# EasyEDA Pro project WearableGasDetect.epro, schematic Schematic4
Create Date: 2025-02-12; Page Name: P1; Project Name: 25大创; Schematic Name: Schematic4; Update Date: 2025-02-22; Company: 嘉立创EDA; Page Size: A4; Version: V1.0
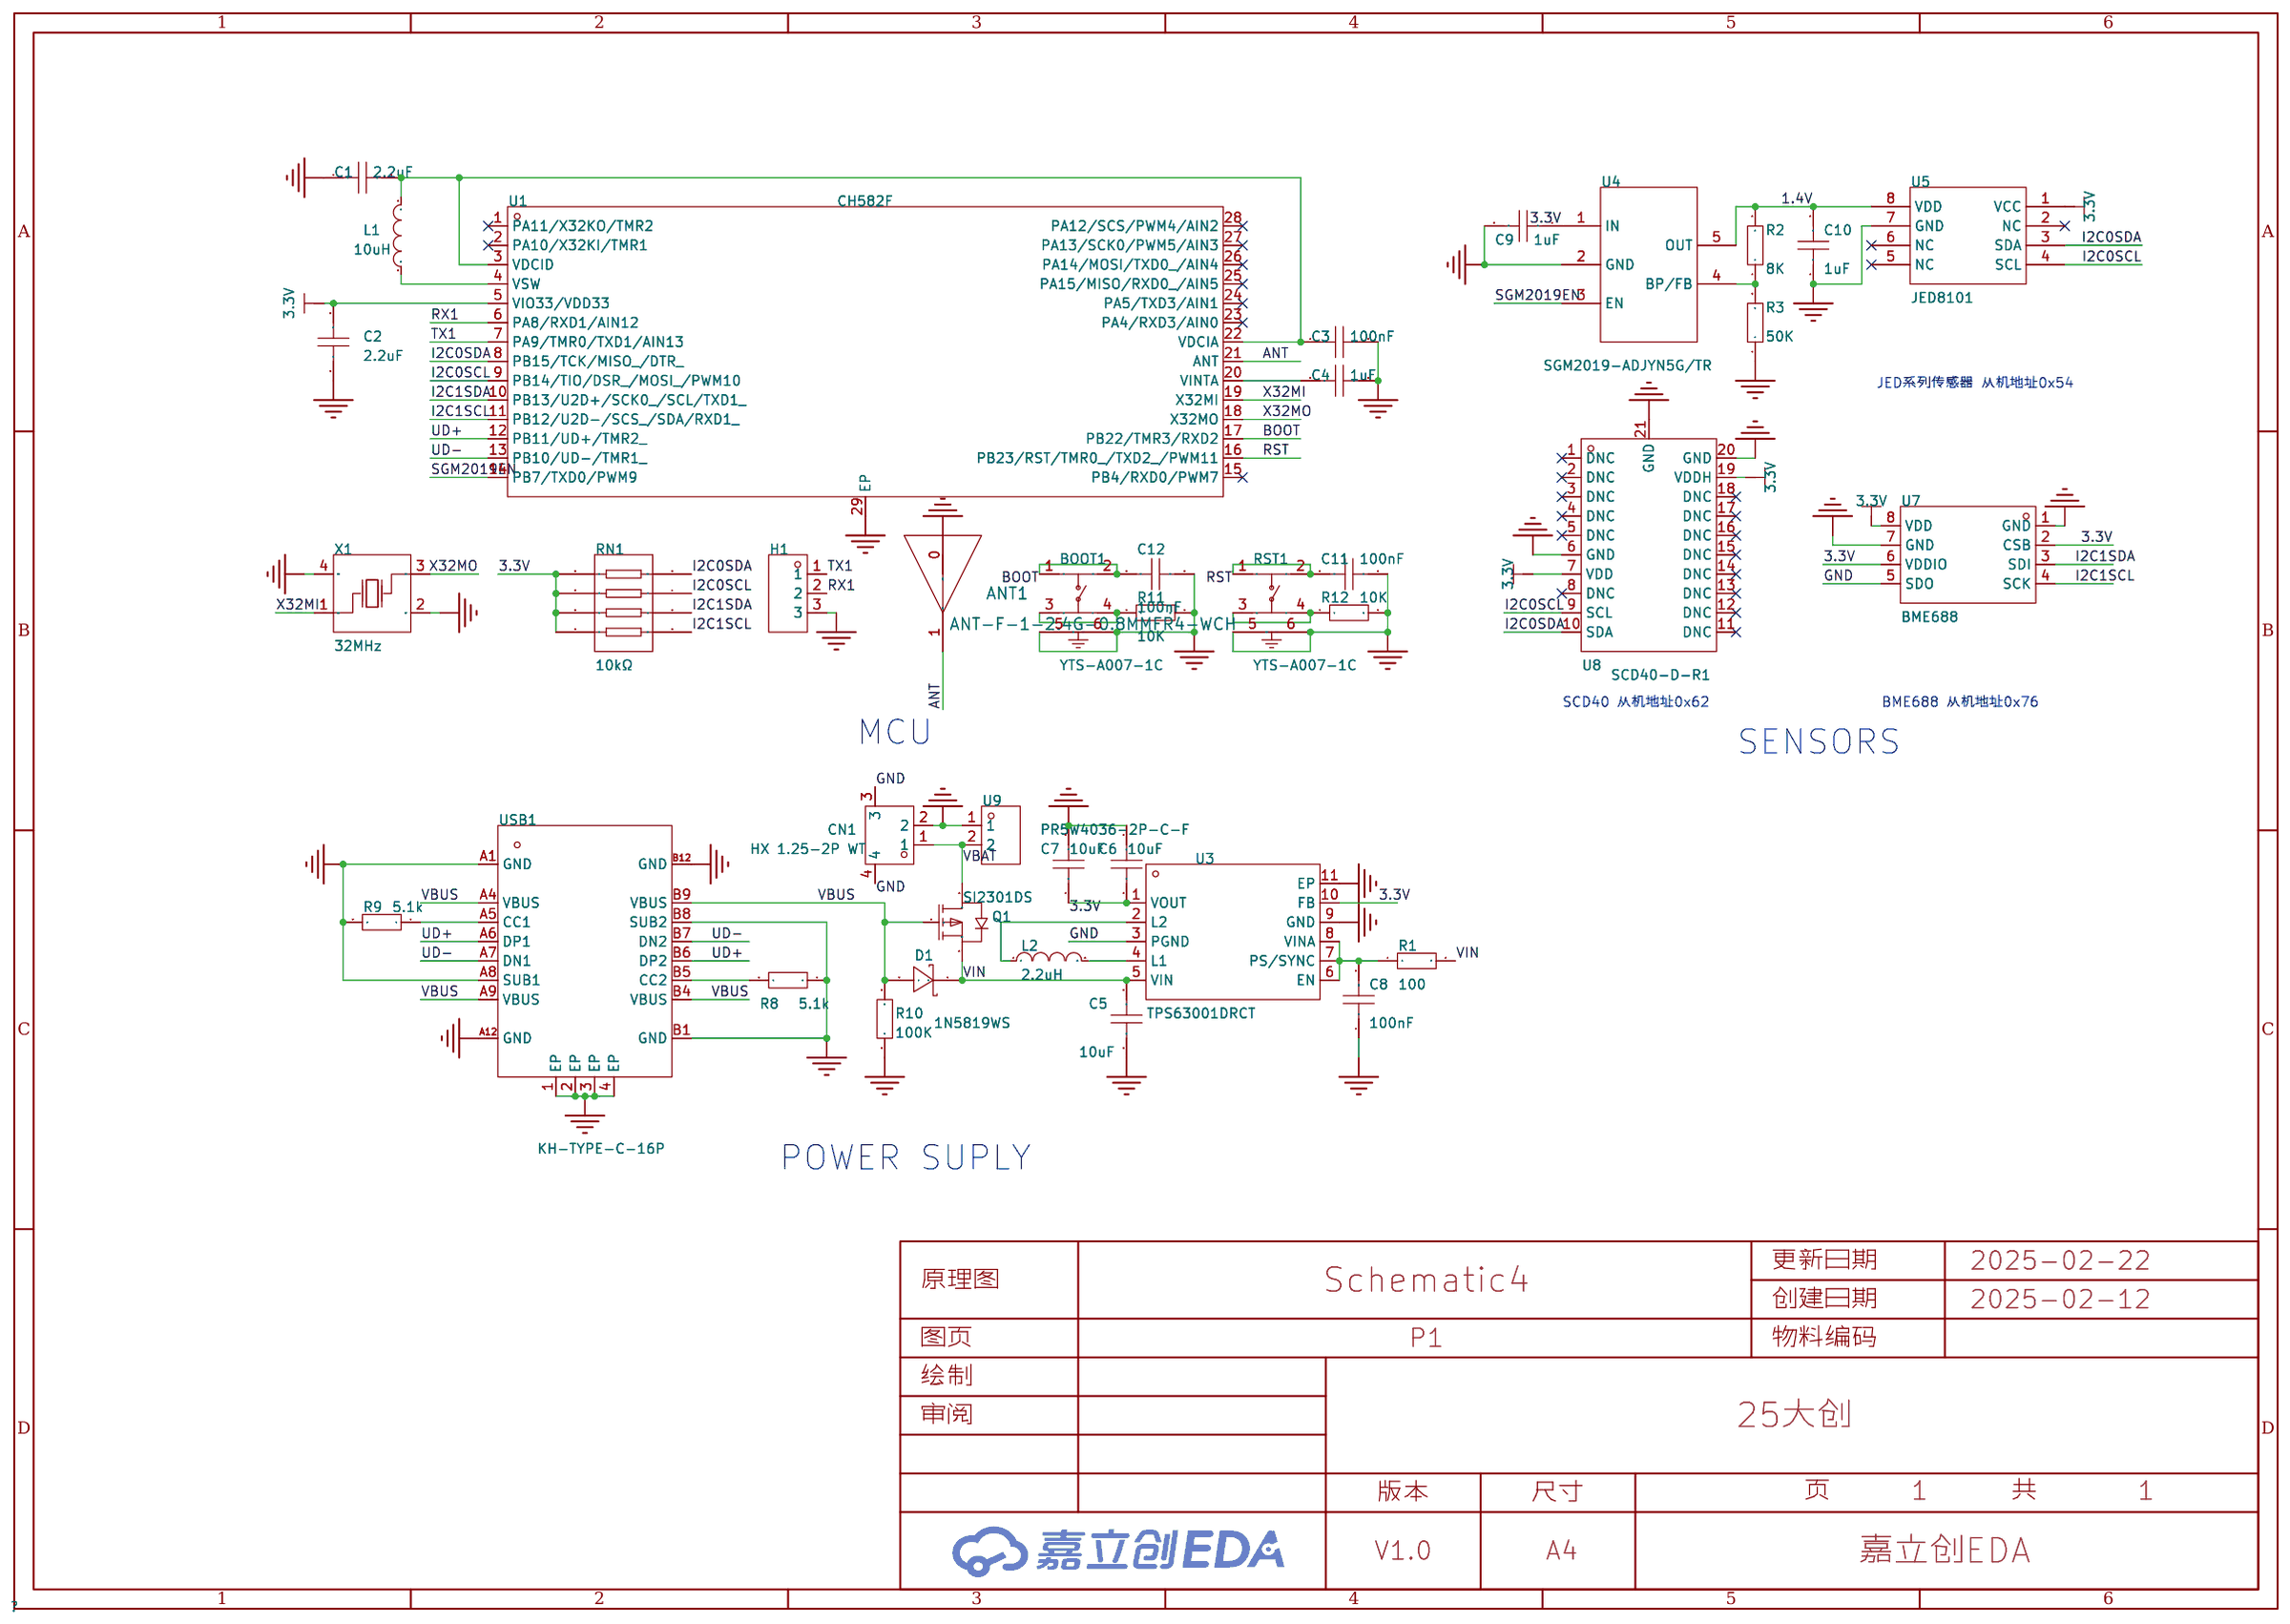
[diagram p2: schematic sheet]

## Parts
ANT1  ANT-F-1-2.4G-0.8MMFR4-WCH  [ANT-F-1-2.4G-0.8MMFR4-WCH]
BOOT1  YTS-A007-1C  [SW-SMD_6P-L3.4-W3.4-P2.00-LS4.0]
C1  2.2uF  [C0402]
C2  2.2uF  [C0402]
C3  100nF  [C0402]
C4  1uF  [C0402]
C5  10uF  [C0603]
C6  10uF  [C0603]
C7  10uF  [C0603]
C8  100nF  [C0402]
C9  1uF  [C0402]
C10  1uF  [C0402]
C11  100nF  [C0402]
C12  100nF  [C0402]
CN1  HX 1.25-2P WT  [CONN-SMD_2P-P1.25_HX1.25-2PWT]
D1  1N5819WS  [SOD-323_L1.8-W1.3-LS2.5-RD]
H1  -  [HDR-TH_3P-P2.54-V-F]
L1  10uH  [IND-SMD_L2.5-W2.0]
L2  2.2uH  [IND-SMD_L4.0-W4.0_VLS4012ET]
Q1  SI2301DS  [SOT-23-3_L2.9-W1.3-P1.90-LS2.4-BR]
R1  100  [R0402]
R2  8K  [R0402]
R3  50K  [R0402]
R8  5.1k  [R0402]
R9  5.1k  [R0402]
R10  100K  [R0402]
R11  10K  [R0402]
R12  10K  [R0402]
RN1  10kΩ  [RES-ARRAY-SMD_0603-8P-L3.2-W1.6-BL]
RST1  YTS-A007-1C  [SW-SMD_6P-L3.4-W3.4-P2.00-LS4.0]
U1  CH582F  [QFN-28_L4.0-W4.0-P0.40-BL-EP2.8]
U3  TPS63001DRCT  [VSON-10_L3.0-W3.0-P0.50-TL-EP]
U4  SGM2019-ADJYN5G/TR  [SOT-23-5_L3.0-W1.7-P0.95-LS2.8-BR]
U5  JED8101  [JED8101]
U7  BME688  [LGA-8_L3.0-W3.0-P0.80_BME688]
U8  SCD40-D-R1  [LGA-20_L10.1-W10.1-P1.25-TL]
U9  PR5W4036-2P-C-F  [CONN-TH_PR5W4036-2P-C-F]
USB1  KH-TYPE-C-16P  [USB-C-SMD_KH-TYPE-C-16P]
X1  32MHz  [CRYSTAL-SMD_4P-L3.2-W2.5-BL]

## Library data of the parts
ANT1 = ANT-F-1-2.4G-0.8MMFR4-WCH
BOOT1 RST1 = YTS-A007-1C: 电路结构:单刀单掷;按钮形状:圆形按钮;作用力:160gf;安装方式:立贴;开关长度:3.4mm;开关宽度:3.35mm;开关高度:2mm;带支架:不带;触点电流:50mA;额定电压(DC):12V;绝缘电阻:100MΩ;机械寿命:10万次;; LCSC Part Name: 3.4*3.35*2mm 立贴 轻触开关; Supplier Part: C2910660; Manufacturer: YIYUAN(怡远); Supplier Footprint: SMD; Datasheet: https://atta.szlcsc.com/upload/public/pdf/source/20211115/F701EB4F96D863066ABC82C6FE41162B.pdf; Supplier: LCSC; Circuit: 单刀单掷; Actuator Style: 圆形按钮; Operating Force: 160gf; Mounting Style: 立贴; Switch Length: 3.4mm; Switch Width: 3.35mm; Switch Height: 2mm; Strike Gundam: 不带; Contact Current: 50mA; Voltage Rating (DC): 12V; Insulation Resistance: 100MΩ; Actuator/Cap Color: 黑色; Pin Style: SMD接片; Mechanical Life: 10万次
C1-C4 C8-C12 = CAP_0402: Supplier Footprint: 0402
C5-C7 = CAP_0603: Supplier Footprint: 0603
CN1 = HX 1.25-2P WT: 插针结构:1x2P;间距:1.25mm;安装方式:卧贴;总PIN数:2P;排数:1;每排PIN数:2;额定电流:1A;工作温度范围:-25℃~+85℃;; LCSC Part Name: 1x2P 间距:1.25mm 卧贴; Supplier Part: C5142069; Manufacturer: hanxia(韩下); Supplier Footprint: SMD,P=1.25mm,卧贴; Datasheet: https://atta.szlcsc.com/upload/public/pdf/source/20220818/902167240A14414EBE70E0F5623727B7.pdf; Supplier: LCSC; Pins Structure: 1x2P; Pitch: 1.25mm; Mounting Style: 卧贴; Number of Pins: 2P; Number of Rows: 1; Number of PINs Per Row: 2; Current Rating (Max): 1A; Operating Temperature Range: -25℃~+85℃
D1 = 1N5819WS_C191023: 正向压降(Vf):600mV@1A;直流反向耐压(Vr):40V;整流电流:1A;; LCSC Part Name: 电压:40V 电流:1A; Supplier Part: C191023; Manufacturer: Hottech(合科泰); Supplier Footprint: SOD-323; JLCPCB Part Class: 基础库; Datasheet: https://atta.szlcsc.com/upload/public/pdf/source/20220428/3CB86FD8D28D653594B4E35F9D5AEFD9.pdf; Supplier: LCSC; Forward Voltage (Vf@If): 600mV@1A; Reverse Voltage (Vr): 40V; Rectified Current: 1A
H1 = HDR-F_2.54_1x3P: Supplier Part: C541850; Supplier Footprint: 插件
L1 = FTC252012S100MBCA: 电感值:10uH;精度:±20%;额定电流:1.2A;饱和电流(Isat):1.6A;类型:一体成型电感;; LCSC Part Name: 10uH ±20% 1.6A; Supplier Part: C5832376; Manufacturer: cjiang(长江微电); Supplier Footprint: SMD,2x2.5mm; Datasheet: https://atta.szlcsc.com/upload/public/pdf/source/20230602/8FFEDA9C0247A92A0D4B67554BFE4091.pdf; Supplier: LCSC; Tolerance: ±20%; Rated Current: 1.2A; Saturation Current (Isat): 1.6A; DC Resistance (DCR): 330mΩ; Type: 一体成型电感
L2 = VLS4012ET-2R2M: 电感值:2.2uH;精度:±20%;额定电流:1.7A;饱和电流(Isat):1.7A;类型:-;; LCSC Part Name: 2.2uH ±20% 1.7A; Supplier Part: C76867; Manufacturer: TDK; Supplier Footprint: SMD; Datasheet: https://atta.szlcsc.com/upload/public/pdf/source/20180327/C76870_107D5296010FCD8D7FC5AB0C4DA9E818.pdf; Supplier: LCSC; Tolerance: ±20%; Rated Current: 1.7A; Saturation Current (Isat): 1.7A; DC Resistance (DCR): 81mΩ
Q1 = SI2301DS: 类型:-;漏源电压(Vdss):20V;连续漏极电流(Id):3A;导通电阻(RDS(on)@Vgs,Id):110mΩ@4.5V,3A;功率(Pd):1W;阈值电压(Vgs(th)@Id):1V@250uA;; LCSC Part Name: 耐压:20V 电流:3A; Supplier Part: C2841444; Manufacturer: TECH PUBLIC(台舟); Supplier Footprint: SOT-23-3; JLCPCB Part Class: 扩展库; Datasheet: https://atta.szlcsc.com/upload/public/pdf/source/20210623/C2841444_F8915202D3D7667D175CCC150AA2E443.pdf; Supplier: LCSC; Drain Source Voltage (Vdss): 20V; Continuous Drain Current (Id): 3A; Drain Source On Resistance (RDS(on)@Vgs,Id): 110mΩ@4.5V,3A; Power Dissipation (Pd): 1W; Gate Threshold Voltage (Vgs(th)@Id): 1V@250uA; Total Gate Charge (Qg@Vgs): 12nC@10V; Input Capacitance (Ciss@Vds): 405pF@10V; Reverse Transfer Capacitance (Crss@Vds): 55pF@10V; Operating Temperature: -55℃~+150℃
R1-R3 R8-R12 = Res_0402: Supplier Footprint: 0402
RN1 = 4D03WGJ0103T5E: 电阻器数:4;阻值:10kΩ;精度:±5%;单个元件功率:62.5mW;温度系数:±200ppm/℃;; LCSC Part Name: 10kΩ ±5%; Supplier Part: C29718; Manufacturer: UNI-ROYAL(厚声); Supplier Footprint: 0603x4; Datasheet: https://atta.szlcsc.com/upload/public/pdf/source/20191224/C474318_2527498AE30E813171187CCD28401A71.pdf; Supplier: LCSC; Number of Resistors: 4; Tolerance: ±5%; Power(Watts): 62.5mW; Temperature Coefficient: ±200ppm/℃; Number of Pins: 8
U1 = CH582F: Supplier Part: C3001175; Manufacturer: WCH(南京沁恒); Supplier Footprint: QFN-28-EP(4x4); Datasheet: https://atta.szlcsc.com/upload/public/pdf/source/20220425/D81D4537E275CD6C7C3E77BC95B144F3.pdf; Supplier: LCSC
U3 = TPS63001DRCT: 功能类型:升降压型;输出类型:固定;输入电压:1.8V~5.5V;输出电压:3.3V;输出电流:1.6A;; LCSC Part Name: TPS6300x 高效单电感降压-升压转换器; Supplier Part: C2070693; Manufacturer: TI(德州仪器); Supplier Footprint: VSON-10-EP(3x3); Datasheet: https://www.ti.com/cn/lit/gpn/tps63000; Supplier: LCSC; Function: 升降压型; Output Type: 固定; Input Voltage: 1.8V~5.5V; Output Voltage: 3.3V; Output Current: 1.6A; Switching Frequency: 1.5MHz; Operating Temperature: -40℃~+85℃@(TA); Synchronous Rectification: 是; Number of Outputs: 1; Topology: 降压-升压式; Switch tube (built-in/external): 内置
U4 = SGM2019-ADJYN5G/TR: 输出类型:-;; Supplier Part: C24330; Manufacturer: SGMICRO(圣邦微); Supplier Footprint: SOT-23-5; Datasheet: https://atta.szlcsc.com/upload/public/pdf/source/20190710/C403702_087BBF2DB9DA7C127CC5D0EF964E6982.pdf; Supplier: LCSC
U5 = JED8101
U7 = BME688_C3664478: 低功耗湿度和温度数字传感器; Supplier Part: C3664478; Manufacturer: Bosch(博世); Supplier Footprint: SMD-8P; Datasheet: https://atta.szlcsc.com/upload/public/pdf/source/20231017/7B3D7968BB5F8FA300E4D9B7C8303659.pdf; Supplier: LCSC
U8 = SCD40-D-R1: 气体类型:空气质量;精度:±5%;; LCSC Part Name: 3.000.496; Supplier Part: C3037696; Manufacturer: Sensirion(瑞士盛思锐); Supplier Footprint: SMD; Datasheet: https://atta.szlcsc.com/upload/public/pdf/source/20230320/B8496A095FB9AF4BA49DBD56DDF6C7AD.pdf; Supplier: LCSC; Type: 空气质量; Resolution: ±5%; Operating Temperature: -10℃~+60℃
U9 = PR5W4036-2P-C-F: 类型:-;PIN位数:-;间距:-;全长/全高:-;工作高度:-;接触电阻:-;弹性寿命:-;额定电流:-;; LCSC Part Name: 2.54-2P磁吸弹簧探针连接器母座折弯脚POGOPIN适配PR5W5036-2P-C-H; Supplier Part: C41361294; Manufacturer: SAMZO(三佐); Datasheet: https://atta.szlcsc.com/upload/public/pdf/source/20240819/D946A8B9BA36A87B2E14CA0FC2EFE10D.pdf; Supplier: LCSC
USB1 = KH-TYPE-C-16P: 连接器类型:Type-C;标准:-;公母:母;端口数量:1;触点数量:16P;安装方式:卧贴;额定电流 - 电源:3A;工作温度范围:-40℃~+85℃;; LCSC Part Name: Type-C 母 卧贴; Supplier Part: C709357; Manufacturer: kinghelm(金航标); Supplier Footprint: SMD; Datasheet: https://atta.szlcsc.com/upload/public/pdf/source/20200911/C709357_AA8DCEB38BB20E3035A7ED7AE7667837.pdf; Supplier: LCSC; Connector Type: Type-C; Gender: 母; Number of Ports: 1; Number of Contacts: 16P; Mounting Style: 卧贴; Current Rating - Power (Max): 3A; Operating Temperature Range: -40℃~+85℃
X1 = X322532MOB4SI: 晶振类型:贴片晶振;频率:32MHz;常温频差:±10ppm;外接负载电容:12pF;频率稳定度(全温):±20ppm;; LCSC Part Name: 32MHz ±10ppm 12pF; Supplier Part: C9009; Manufacturer: YXC(扬兴晶振); Supplier Footprint: SMD3225-4P; Datasheet: https://atta.szlcsc.com/upload/public/pdf/source/20240329/19D5F850207469550BEB00D7DFEDBC7A.pdf; Supplier: LCSC; Crystal Type: 贴片晶振; Normal temperature Frequency Tolerance: ±10ppm; External load capacitor: 12pF; Frequency Stability(Full temperature range): ±20ppm; Operating Temperature: -40℃~+85℃

## Nets
1.4V: C10.2 R2.2 U4.5(OUT) U5.8(VDD)
3.3V: C2.2 C6.1 C7.1 C9.1 RN1.1 RN1.2 RN1.3 RN1.4 U1.5(VIO33/VDD33) U3.1(VOUT) U3.10(FB) U4.1(IN) U5.1(VCC) U7.2(CSB) U7.6(VDDIO) U7.8(VDD) U8.7(VDD) U8.19(VDDH)
GND: ANT1.0(GND) BOOT1.5(GND) BOOT1.6(GND) C1.1 C2.1 C3.2 C4.2 C5.1 C6.2 C7.2 C8.1 C9.2 C10.1 C11.1 C12.1 CN1.2 CN1.3 CN1.4 H1.3 R3.1 R8.1 R9.2 R10.1 R11.2 R12.2 RST1.5(GND) RST1.6(GND) U1.29(EP) U3.3(PGND) U3.9(GND) U3.11(EP) U4.2(GND) U5.7(GND) U7.1(GND) U7.5(SDO) U7.7(GND) U8.6(GND) U8.20(GND) U8.21(GND) U9.1 USB1.1(EP) USB1.2(EP) USB1.3(EP) USB1.4(EP) USB1.A1(GND) USB1.A8(SUB1) USB1.A12(GND) USB1.B1(GND) USB1.B8(SUB2) USB1.B12(GND) X1.2(GND) X1.4(GND)
VBAT: CN1.1 Q1.3(D) U9.2
VBUS: D1.2(A) Q1.1(G) R10.2 USB1.A4(VBUS) USB1.A9(VBUS) USB1.B4(VBUS) USB1.B9(VBUS)
VIN: C5.2 D1.1(K) Q1.2(S) R1.2 U3.5(VIN)
ANT: ANT1.1 U1.21(ANT)
BOOT: BOOT1.1 BOOT1.2 C12.2 U1.17(PB22/TMR3/RXD2)
I2C0SCL: RN1.7 U1.9(PB14/TIO/DSR_/MOSI_/PWM10) U5.4(SCL) U8.9(SCL)
I2C0SDA: RN1.8 U1.8(PB15/TCK/MISO_/DTR_) U5.3(SDA) U8.10(SDA)
I2C1SCL: RN1.5 U1.11(PB12/U2D-/SCS_/SDA/RXD1_) U7.4(SCK)
I2C1SDA: RN1.6 U1.10(PB13/U2D+/SCK0_/SCL/TXD1_) U7.3(SDI)
RST: C11.2 RST1.1 RST1.2 U1.16(PB23/RST/TMR0_/TXD2_/PWM11)
RX1: H1.2 U1.6(PA8/RXD1/AIN12)
SGM2019EN: U1.14(PB7/TXD0/PWM9) U4.3(EN)
TX1: H1.1 U1.7(PA9/TMR0/TXD1/AIN13)
UD+: U1.12(PB11/UD+/TMR2_) USB1.A6(DP1) USB1.B6(DP2)
UD-: U1.13(PB10/UD-/TMR1_) USB1.A7(DN1) USB1.B7(DN2)
X32MI: U1.19(X32MI) X1.1(OSC1)
X32MO: U1.18(X32MO) X1.3(OSC2)
$1N4981: L1.2 U1.4(VSW)
$1N4984: C1.2 C3.1 L1.1 U1.3(VDCID) U1.22(VDCIA)
$1N4985: C4.1 U1.20(VINTA)
$1N4995: L2.1 U3.2(L2)
$1N4996: L2.2 U3.4(L1)
$1N5005: C8.2 R1.1 U3.6(EN) U3.7(PS/SYNC) U3.8(VINA)
$1N5014: R2.1 R3.2 U4.4(BP/FB)
$1N5064: R8.2 USB1.B5(CC2)
$1N5066: R9.1 USB1.A5(CC1)
$1N5088: R12.1 RST1.3 RST1.4
$1N5101: BOOT1.3 BOOT1.4 R11.1

Not connected (* = marked no-connect by the designer): U1 1(PA11/X32KO/TMR2)* 2(PA10/X32KI/TMR1)* 15(PB4/RXD0/PWM7)* 23(PA4/RXD3/AIN0)* 24(PA5/TXD3/AIN1)* 25(PA15/MISO/RXD0_/AIN5)* 26(PA14/MOSI/TXD0_/AIN4)* 27(PA13/SCK0/PWM5/AIN3)* 28(PA12/SCS/PWM4/AIN2)*; U5 2(NC)* 5(NC)* 6(NC)*; U8 1(DNC)* 2(DNC)* 3(DNC)* 4(DNC)* 5(DNC)* 8(DNC)* 11(DNC)* 12(DNC)* 13(DNC)* 14(DNC)* 15(DNC)* 16(DNC)* 17(DNC)* 18(DNC)*

## Notes on the sheet
- JED系列传感器 从机地址0x54
- SCD40 从机地址0x62
- BME688 从机地址0x76
- MCU
- SENSORS
- POWER SUPLY
